# Altium schematic sheet Power.SchDoc
size 420 x 297 mm; Author: AzekClark; CompanyName: AzekClark; Address1: Address1; Address2: Address2; Address3: Address3; Address4: Address4; DocumentNumber: StairsLED; SheetNumber: 2; SheetTotal: 4; Scale: 1:1; EngineerName: AzekClark; DocumentType: Схема электрическая принципиальная; FirstReferrence: StairsLED
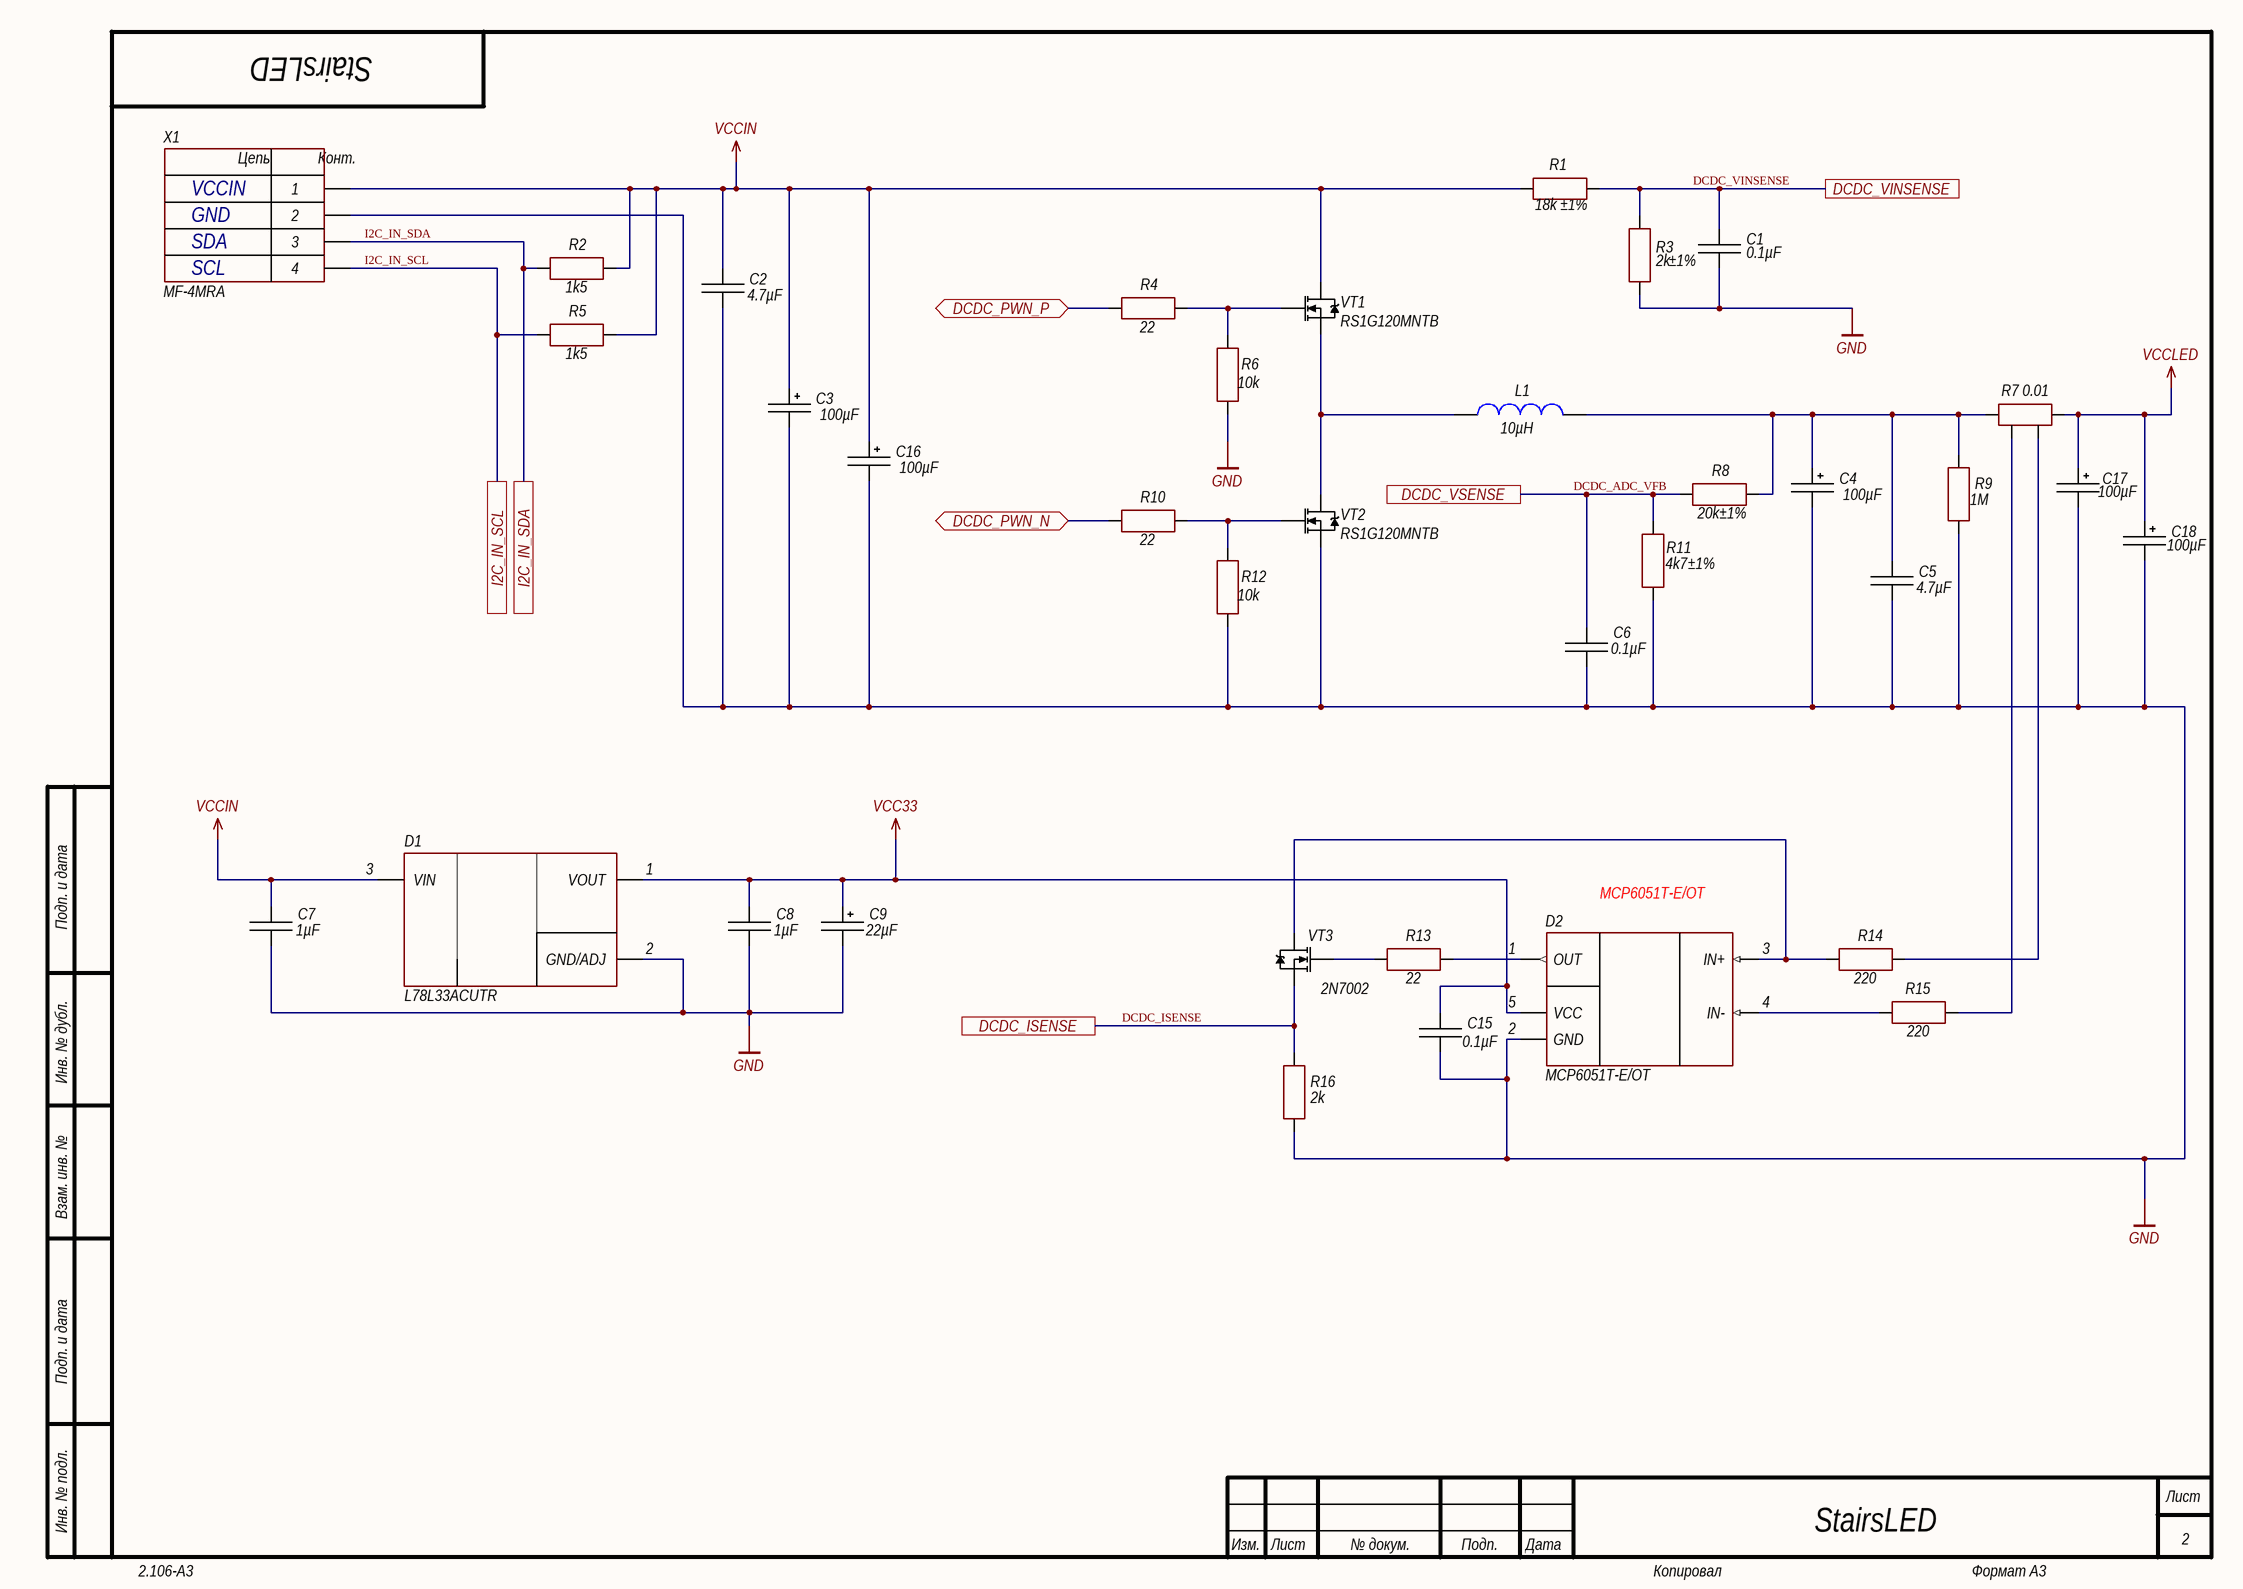
[diagram p0: Power.SchDoc]

## Parts
C1  0.1µF  [CH0603C]
C2  4.7µF  [CH1206C]
C3  100µF  [D6.3C2.5H11]
C4  100µF  [D6.3C2.5H11]
C5  4.7µF  [CH1206C]
C6  0.1µF  [CH0603C]
C7  1µF  [CH0603C]
C8  1µF  [CH0603C]
C9  22µF  [TANTAL_B]
C15  0.1µF  [CH0603C]
C16  100µF  [D6.3C2.5H11]
C17  100µF  [D6.3C2.5H11]
C18  100µF  [D6.3C2.5H11]
D1  L78L33ACUTR  [SOT89_123]
D2  MCP6051T-E/OT  [SOT23-5]
L1  10µH  [IND: CDRH127]
R1  18k  ComponentKind: ±1%  [CH0603R]
R2  1k5  [CH0603R]
R3  2k  ComponentKind: ±1%  [CH0603R]
R4  22  [CH0603R]
R5  1k5  [CH0603R]
R6  10k  [CH0603R]
R7  0.01  [SHNT: CRA2512]
R8  20k  ComponentKind: ±1%  [CH0603R]
R9  1M  [CH1206R]
R10  22  [CH0603R]
R11  4k7  ComponentKind: ±1%  [CH0603R]
R12  10k  [CH0603R]
R13  22  [CH0603R]
R14  220  [CH0603R]
R15  220  [CH0603R]
R16  2k  [CH0603R]
VT1  RS1G120MNTB  [8-TDSON]
VT2  RS1G120MNTB  [8-TDSON]
VT3  2N7002  [SOT23_132]
X1  MF-4MRA  [CON: MF-4MRA]

## Ports
DCDC_ISENSE, DCDC_PWN_N (bidir), DCDC_PWN_P (bidir), DCDC_VINSENSE, DCDC_VSENSE, I2C_IN_SCL, I2C_IN_SDA

## Nets
GND: C1.2 C2.1 C3.2 C4.2 C5.1 C6.2 C7.1 C8.1 C9.2 C15.1 C16.2 C17.2 C18.2 D1.2(GND/ADJ) D2.2(GND) R3.1 R6.1 R9.1 R11.1 R12.1 R16.1 VT2.3(S) X1.2
VCC33: C8.2 C9.1 C15.2 D1.1(VOUT) D2.5(VCC)
VCCIN: C2.2 C3.1 C7.2 C16.1 D1.3(VIN) R1.2 R2.2 R5.2 VT1.2(D) X1.1
VCCLED: C17.1 C18.1 R7.2
DCDC_ADC_VFB: C6.1 R8.1 R11.2 ; port DCDC_VSENSE
DCDC_ISENSE: R16.2 VT3.3(S) ; port DCDC_ISENSE
DCDC_PWN_N: R10.1 ; port DCDC_PWN_N
DCDC_PWN_P: R4.1 ; port DCDC_PWN_P
DCDC_VINSENSE: C1.1 R1.1 R3.2 ; port DCDC_VINSENSE
I2C_IN_SCL: R5.1 X1.4 ; port I2C_IN_SCL
I2C_IN_SDA: R2.1 X1.3 ; port I2C_IN_SDA
NetC4_1: C4.1 C5.2 L1.1 R7.1 R8.2 R9.2
NetD2_1: D2.1(OUT) R13.2
NetD2_3: D2.3(IN+) R14.1 VT3.2(D)
NetD2_4: D2.4(IN-) R15.1
NetL1_2: L1.2 VT1.3(S) VT2.2(D)
NetR4_2: R4.2 R6.2 VT1.1(G)
NetR7_3: R7.3 R15.2
NetR7_4: R7.4 R14.2
NetR10_2: R10.2 R12.2 VT2.1(G)
NetR13_1: R13.1 VT3.1(G)

## Notes on the sheet
- VCCIN
- SDA
- GND
- SCL
- MCP6051T-E/OT
- Подп. и дата
- Инв. № дубл.
- Взам. инв. №
- Инв. № подл.
- Изм.
- Лист
- № докум.
- Подп.
- Дата
- 2.106-A3
- Копировал
- Формат А3
- (in symbol 4-Connector) Цепь; Конт.

## Library data of the parts
C1 C6 C15 = Capacitor: Manufacturer: *; Model: *; HelpURL: *; ComponentKind: *; Value: 0.1µF
C2 C5 = Capacitor: Manufacturer: Murata; Model: GRM31CR71H475KA12; HelpURL: https://www.chipdip.ru/product/grm31cr71h475ka12l; ComponentKind: 50V, X7R; Value: 4.7µF
C3 C4 C16-C18 = AlumCap: Manufacturer: BURNON; Model: -; HelpURL: https://www.chipdip.ru/product0/8001594426; ComponentKind: 35V; Value: 100µF
C7 C8 = Capacitor: Manufacturer: Murata Electronics Inc.; Model: GRM188R71C105KE15D; HelpURL: https://www.terraelectronica.ru/product/2094261; ComponentKind: X5R; Value: 1µF
C9 = TantalCap: Manufacturer: *; Model: *; HelpURL: *; ComponentKind: *; Value: 22µF
D1 = L78LxxACUTR: Step-down; Manufacturer: ST Microelectronics; Model: L78L33ACUTR; HelpURL: https://www.st.com/resource/en/datasheet/l78l.pdf; ComponentKind: SOT-89, 100mA
D2 = MCP6001T: OP amplifier; Manufacturer: Microchip Technology; Model: MCP6051T-E/OT; HelpURL: https://www.digikey.com/product-detail/en/microchip-technology/MCP6001T-I-OT/MCP6001T-I-OTCT-ND/697158; ComponentKind: SOT23-5
L1 = Inductor: Manufacturer: Sumida Electric; Model: SCDS127T-100M-N; HelpURL: https://www.chipdip.ru/product0/9000523882; ComponentKind: 5.4A; Value: 10µH
R1-R6 R8-R16 = Resistor: Manufacturer: *; Model: *; HelpURL: *
  R1: Value: 18k
  R2 R5: ComponentKind: *; Value: 1k5
  R3: Value: 2k
  R4 R10 R13: ComponentKind: *; Value: 22
  R6 R12: ComponentKind: *; Value: 10k
  R8: Value: 20k
  R9: ComponentKind: *; Value: 1M
  R11: Value: 4k7
  R14 R15: ComponentKind: *; Value: 220
  R16: ComponentKind: *; Value: 2k
R7 = Shunt: Manufacturer: Bourns; Model: CRA2512-FZ-R010ELF; HelpURL: https://static6.arrow.com/aropdfconversion/58bb460c8d6e9e02f20276cbc5e1de2f00a5855b/815cra.pdf; ComponentKind: 3W; Value: 0.01
VT1 VT2 = N-chanel: Mosfet; Manufacturer: Rohm; Model: RS1G120MNTB; ComponentKind: 40V, 13A, 61mOm; HelpURL: https://www.rohm.com/datasheet/RQ3L050GN/rq3l050gntb-e
VT3 = N-chanel: Mosfet; Manufacturer: ON Semiconductor; Model: 2N7002; ComponentKind: 0.2А, 60В; HelpURL: https://static.chipdip.ru/lib/318/DOC000318735.pdf
X1 = 4-Connector: Model: MF-4MRA; Manufacturer: *; HelpURL: *; ComponentKind: *